# EAGLE schematic untitled (EAGLE 7.6.0)
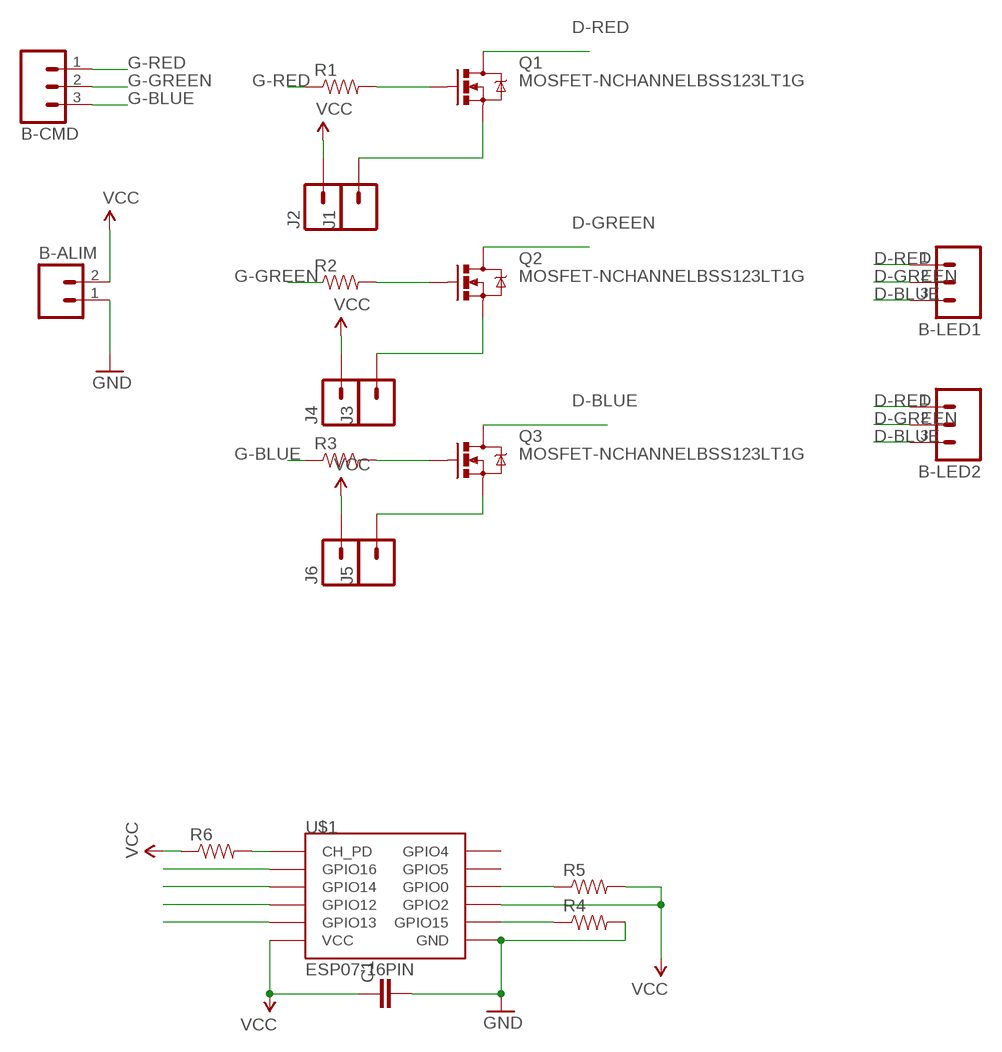
[diagram p0: schematic, sheet 1]

## Parts
B-ALIM  M02PTH  [1X02]
B-CMD  M03PTH  [1X03]
B-LED1  M03PTH  [1X03]
B-LED2  M03PTH  [1X03]
C1  CAP0805  [0805]
J1  M01PTH  [1X01]
J2  M01PTH  [1X01]
J3  M01PTH  [1X01]
J4  M01PTH  [1X01]
J5  M01PTH  [1X01]
J6  M01PTH  [1X01]
Q1  MOSFET-NCHANNELBSS123LT1G  [SOT23-3]
Q2  MOSFET-NCHANNELBSS123LT1G  [SOT23-3]
Q3  MOSFET-NCHANNELBSS123LT1G  [SOT23-3]
R1  RESISTOR0805-RES  [0805]
R2  RESISTOR0805-RES  [0805]
R3  RESISTOR0805-RES  [0805]
R4  RESISTOR0805-RES  [0805]
R5  RESISTOR0805-RES  [0805]
R6  RESISTOR0805-RES  [0805]
U$1  ESP07-16PIN  [ESP07-16PIN]

## Nets
B-BLUE: U$1.GPIO16
D-BLUE: B-LED1.3 B-LED2.3 Q3.3(D)
D-GREEN: B-LED1.2 B-LED2.2 Q2.3(D)
D-RED: B-LED1.1 B-LED2.1 Q1.3(D)
G-BLUE: B-CMD.3 R3.1
G-GREEN: B-CMD.2 U$1.GPIO14
G-RED: B-CMD.1 R1.1 U$1.GPIO12
GND: B-ALIM.1 C1.2 R4.2 U$1.GND
N$1: Q1.1(G) R1.2
N$2: Q2.1(G) R2.2
N$3: Q3.1(G) R3.2
N$4: R6.2 U$1.CH_PD
N$5: R5.1 U$1.GPIO0
N$6: R4.1 U$1.GPIO15
N$7: J1.1 Q1.2(S)
N$8: J3.1 Q2.2(S)
N$9: J5.1
SBUTTON: U$1.GPIO13
VCC: B-ALIM.2 C1.1 R5.2 R6.1 U$1.GPIO2 U$1.VCC
Unconnected: J2.1 J4.1 J6.1 Q3.2(S) R2.1 U$1.GPIO4 U$1.GPIO5

## Library data of the parts
B-ALIM = SparkFun-Connectors:M02: Standard 2-pin 0.1" header. Use with - straight break away headers ( PRT-00116) - right angle break away headers (PRT-00553) - swiss pins (PRT-00743) - machine pins (PRT-00117) - female headers (PRT-00115) Molex polarized connector foot print use with: PRT-08233 with associated crimp pins and housings. 2.54_SCREWTERM for use with PRT-10571. 3.5mm Screw Terminal footprints for PRT-08084 5mm Screw Terminal footprints for use with PRT-08432
B-CMD B-LED1 B-LED2 = SparkFun-Connectors:M03: Header 3 Standard 3-pin 0.1" header. Use with straight break away headers (SKU : PRT-00116), right angle break away headers (PRT-00553), swiss pins (PRT-00743), machine pins (PRT-00117), and female headers (PRT-00115). Molex polarized connector foot print use with SKU : PRT-08232 with associated crimp pins and housings.
C1 = SparkFun-Passives:CAP: Capacitor Standard 0603 ceramic capacitor, and 0.1" leaded capacitor.
J1-J6 = SparkFun-Connectors:M01: Header 1 Standard 1-pin 0.1" header. Use with straight break away headers (SKU : PRT-00116), right angle break away headers (PRT-00553), swiss pins (PRT-00743), machine pins (PRT-00117), and female headers (PRT-00115). SMTSO-256-ET is a "flush mount" nut for a 4-40 screw. The older package used to be too tight, and did not allow it to sit properly thru the drill hit. The latest (0.165DIA) fits nice and snug.
Q1-Q3 = SparkFun-DiscreteSemi:MOSFET-NCHANNEL: Common NMOSFET Parts MFG P/N Store ID Prod ID FDD8780 TRANS-09984 SI7820DN TRANS-11055 FDS6630A IC-08089 2N7002PW TRANS-11151 FQP30N06L COM-10213 TRANS-10060 BSS123LT1G TRANS-08345 BSS138 TRANS-00830 BS170 2N7000; PROD_ID: TRANS-08345
R1-R6 = SparkFun-Passives:RESISTOR: Resistor Basic schematic elements and footprints for 0603, 1206, and PTH resistors.
U$1 = baballe-module:ESP07-16PIN: ESP8266 Wifi module 07 - 16 pins; DIMENSIONS: 22.0 x 16.0 mm; PINS: 16; PITCH: 0.078" / 2 mm